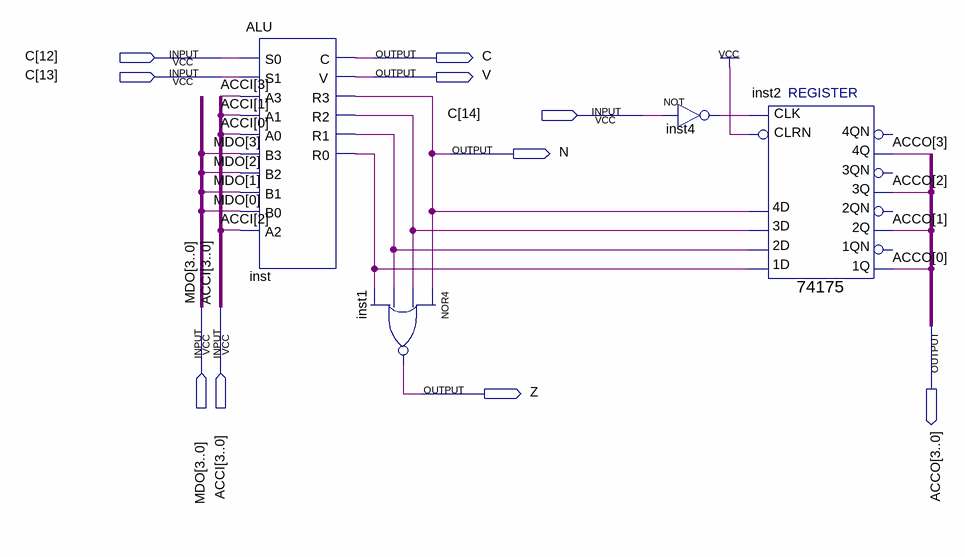
[diagram p0: schematic sheet]
// Quartus schematic TRISCALU.bdf as structural Verilog: 4 symbols, 10 pins
module TRISCALU (
  input  [14:12] C,
  input  [3:0] MDO,
  input  [3:0] ACCI,
  output C_1bit,
  output V,
  output N,
  output [3:0] ACCO,
  output Z
);

  wire inst4_out, inst_r0, inst_r1, inst_r2;

  ALU inst (
    .S0(C[12]), .S1(C[13]), .A3(ACCI[3]), .A1(ACCI[1]), .A0(ACCI[0]), .B3(MDO[3]), .B2(MDO[2]), .B1(MDO[1]),
    .B0(MDO[0]), .A2(ACCI[2]), .C(C_1bit), .V(V), .R3(N), .R2(inst_r2), .R1(inst_r1), .R0(inst_r0));
  nor inst1 (Z, N, inst_r2, inst_r1, inst_r0);
  not inst4 (inst4_out, C[14]);
  \74175  inst2 (
    .CLRN(1'b1), .CLK(inst4_out), .\3D (inst_r2), .\2D (inst_r1), .\1D (inst_r0), .\4D (N), .\1Q (ACCO[0]),
    .\3Q (ACCO[2]), .\2Q (ACCO[1]), .\4Q (ACCO[3]));  // open: 1QN, 2QN, 4QN, 3QN
endmodule
